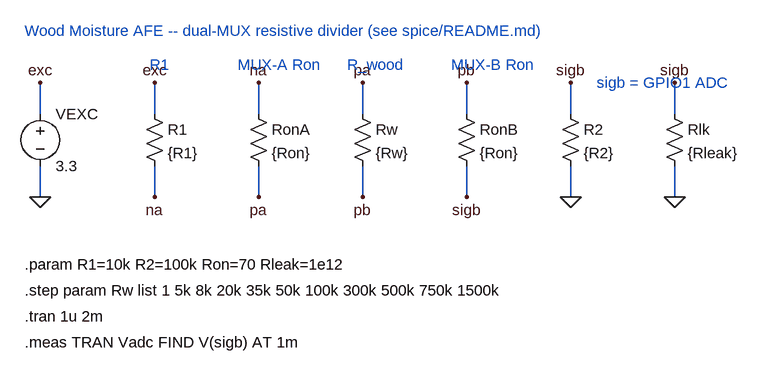
[diagram p0: schematic wood_afe_sch.asc]
wood_afe_sch.asc, the LTspice schematic file:
Version 4
SHEET 1 1600 900
WIRE 144 224 144 176
WIRE 144 304 144 352
WIRE 320 224 320 176
WIRE 320 304 320 352
WIRE 480 224 480 176
WIRE 480 304 480 352
WIRE 640 224 640 176
WIRE 640 304 640 352
WIRE 800 224 800 176
WIRE 800 304 800 352
WIRE 960 224 960 176
WIRE 960 304 960 352
WIRE 1120 224 1120 176
WIRE 1120 304 1120 352
FLAG 144 176 exc
FLAG 144 352 0
FLAG 320 176 exc
FLAG 320 352 na
FLAG 480 176 na
FLAG 480 352 pa
FLAG 640 176 pa
FLAG 640 352 pb
FLAG 800 176 pb
FLAG 800 352 sigb
FLAG 960 176 sigb
FLAG 960 352 0
FLAG 1120 176 sigb
FLAG 1120 352 0
SYMBOL voltage 144 208 R0
SYMATTR InstName VEXC
SYMATTR Value 3.3
SYMBOL res 304 208 R0
SYMATTR InstName R1
SYMATTR Value {R1}
SYMBOL res 464 208 R0
SYMATTR InstName RonA
SYMATTR Value {Ron}
SYMBOL res 624 208 R0
SYMATTR InstName Rw
SYMATTR Value {Rw}
SYMBOL res 784 208 R0
SYMATTR InstName RonB
SYMATTR Value {Ron}
SYMBOL res 944 208 R0
SYMATTR InstName R2
SYMATTR Value {R2}
SYMBOL res 1104 208 R0
SYMATTR InstName Rlk
SYMATTR Value {Rleak}
TEXT 120 96 Left 2 ;Wood Moisture AFE -- dual-MUX resistive divider (see spice/README.md)
TEXT 312 148 Left 2 ;R1
TEXT 448 148 Left 2 ;MUX-A Ron
TEXT 616 148 Left 2 ;R_wood
TEXT 776 148 Left 2 ;MUX-B Ron
TEXT 1000 176 Left 2 ;sigb = GPIO1 ADC
TEXT 120 456 Left 2 !.param R1=10k R2=100k Ron=70 Rleak=1e12
TEXT 120 496 Left 2 !.step param Rw list 1 5k 8k 20k 35k 50k 100k 300k 500k 750k 1500k
TEXT 120 536 Left 2 !.tran 1u 2m
TEXT 120 576 Left 2 !.meas TRAN Vadc FIND V(sigb) AT 1m

The netlist it stands for:
* wood_afe_sch.asc
VEXC exc 0 3.3
R1 exc na {R1}
RonA na pa {Ron}
Rw pa pb {Rw}
RonB pb sigb {Ron}
R2 sigb 0 {R2}
Rlk sigb 0 {Rleak}
* Wood Moisture AFE -- dual-MUX resistive divider (see spice/README.md)
* R1
* MUX-A Ron
* R_wood
* MUX-B Ron
* sigb = GPIO1 ADC
.param R1=10k R2=100k Ron=70 Rleak=1e12
.step param Rw list 1 5k 8k 20k 35k 50k 100k 300k 500k 750k 1500k
.tran 1u 2m
.meas TRAN Vadc FIND V(sigb) AT 1m
.backanno
.end